# EAGLE design breakout-ws2812 (EAGLE 6.5.0)
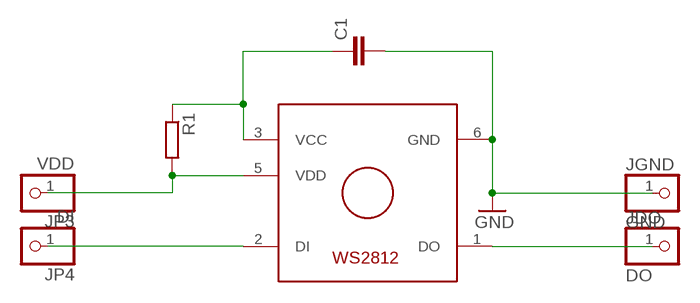
[diagram p0: schematic, sheet 1]

## Parts
C1  C-EUC1206  [C1206]
JDO  DO  PINHD-1X1  [1X01]
JGND  GND  PINHD-1X1  [1X01]
JP3  VDD  PINHD-1X1  [1X01]
JP4  DI  PINHD-1X1  [1X01]
R1  R-EU_R1206  [R1206]
U$1  WS2812  [WS2812]

## Nets
GND: C1.2 JGND.1 U$1.6(GND)
JDI: JP4.1 U$1.2(DI)
N$2: JDO.1 U$1.1(DO)
VCC: C1.1 R1.1 U$1.3(VCC)
VDD: JP3.1 R1.2 U$1.5(VDD)

## Library data of the parts
C1 = resistor:C-EU: CAPACITOR, European symbol
JDO JGND JP3 JP4 = pinhead:PINHD-1X1: PIN HEADER
R1 = resistor:R-EU_: RESISTOR, European symbol
U$1 = n39:WS2812: WS2812 — Intelligent control LED integrated light source General description WS2812 is a intelligent control LED light source that the control circuit and RGB chip are integrated in a package of 5050 components. It internal include intelligent digital port data latch and signal reshaping amplification drive circuit. Also include a precision internal oscillator and a 12V voltage programmable constant curre-nt control part, effectively ensuring the pixel point light color height consistent. The data transfer protocol use single NZR communication mode. After the pixel power-on reset, the DIN port receive data from controller, the first pixel collect initial 24bit data then sent to the internal data latch, the other data which reshaping by the internal signal reshaping amplification circuit sent to the next cascade pixel through the DO port. After transmission for each pixel,the signal to reduce 24bit. pixel adopt auto resha -ping transmit technology, making the pixel cascade number is not limited the signal transmission, only depend on the speed of signal transmission. LED with low driving voltage, environmental protection and energy saving, high brightness, scattering angle is large, good consistency, low power, long life and other advantages. The control chip integrated in LED above becoming more simple circuit, small volume, convenient installation.

## Board
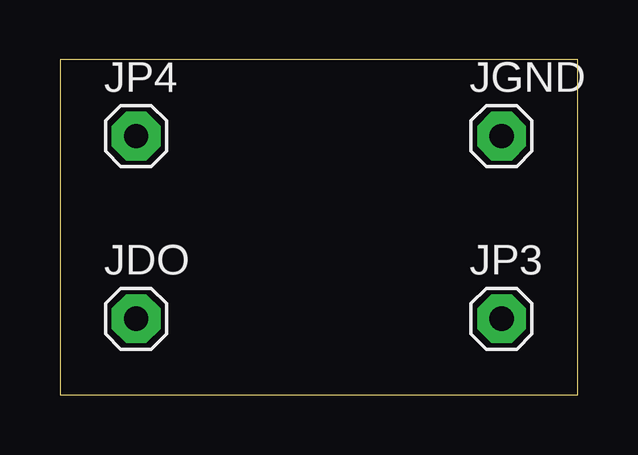
[diagram p1: board, top side]
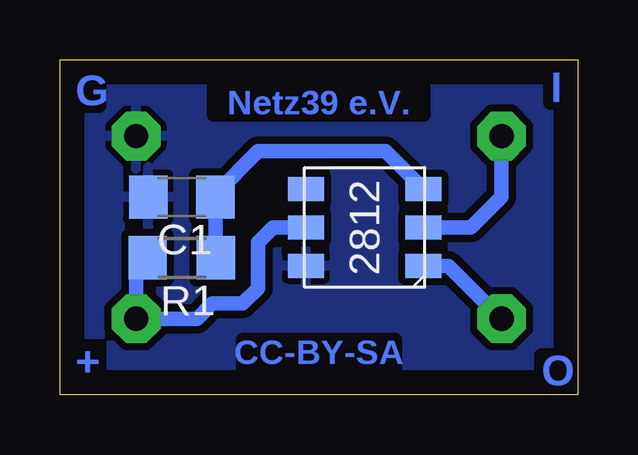
[diagram p2: board, bottom side, seen from below]

Size 21.59 x 13.97 mm. Coordinates in mm from the lower left corner, seen from the top.
Outline: 0,0 21.59,0 21.59,13.97 0,13.97 0,0
Copper layers (1*16): Top 0.035mm / dielectric 1.5mm / Bottom 0.035mm
Design rules "default *": minimum track width 12mil, minimum drill 24mil, track to track 12mil, track to pad 12mil, pad to pad 12mil, via to via 12mil, smd to smd 8mil, copper to edge 40mil, drill to drill 8mil, minimum pad ring 20mil, minimum via ring 12mil, stop-mask expansion 4mil, vias tented up to drill 0mil, thermal gap 10mil

### Footprints (pad centres in the part's own frame; a part is rotated, then mirrored left to right if it is on the bottom)
C1206 = smd 1.6 x 1.8: 1 -1.4,0; 2 1.4,0
1X01 = drill 1.016 octagon: 1 0,0
R1206 = smd 1.6 x 1.803: 1 -1.422,0; 2 1.422,0
WS2812 = smd 1.5 x 1: 1 2.45,-1.6; 2 2.45,0; 3 2.45,1.6; 4 -2.45,1.6; 5 -2.45,0; 6 -2.45,-1.6

### Placement (x,y rotation side)
C1  16.51,8.26 180 bottom
JDO  3.17,3.17 0 top
JGND  18.41,10.79 0 top
JP3  18.41,3.17 0 top
JP4  3.17,10.79 0 top
R1  16.51,5.71 180 bottom
U$1  8.89,6.99 0 bottom

### Tracks (layer width: path | path; a pad name or v marks a point on that pad's centre or on a via)
GND
  pour Bottom: 0,13.97 21.59,13.97 21.59,0 0,0
JDI
  Bottom 0.61: U$1.2 4.45,6.99 3.17,8.26 JP4.1
N$2
  Bottom 0.61: U$1.1 5.38,5.38 JDO.1
VCC
  Bottom 0.61: R1.1 15.11,5.71 C1.1 15.11,8.38 13.34,10.16 8.02,10.16 U$1.3
VDD
  Bottom 0.61: U$1.5 12.7,6.99 13.34,6.35 13.34,4.45 13.97,3.81 15.24,3.81 15.88,3.17 JP3.1 18.41,5.23 R1.2

### Text on the board
Bottom: Netz39 e.V. | I | G | CC-BY-SA | + | O